# Altium schematic sheet 200_DCDC_5V-3V3_USBC.SchDoc
size B; SheetNumber: 4; SheetTotal: 4
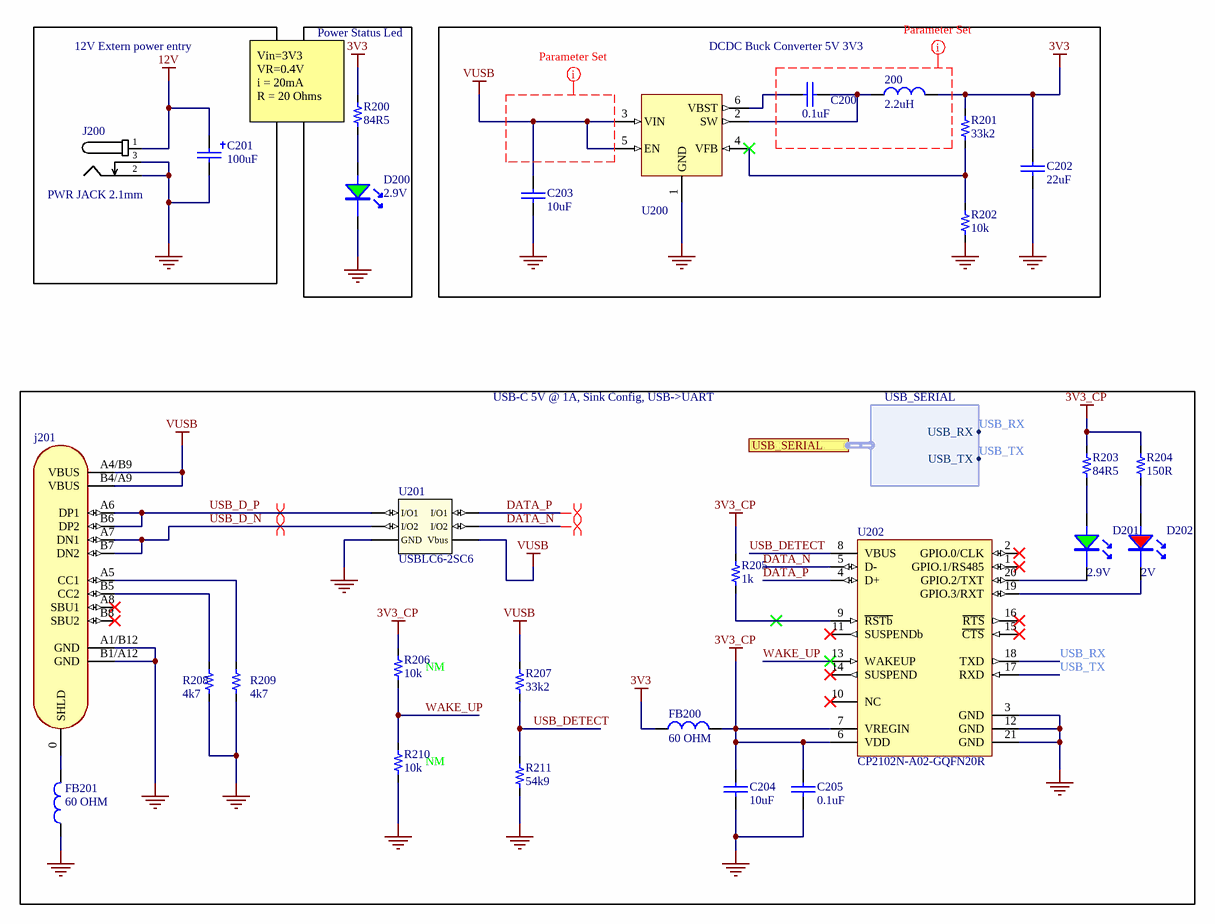
[diagram p0: 200_DCDC_5V-3V3_USBC.SchDoc]

## Parts
200  value 2.2uH  [Ind_5.8*5.2_NS]  (hidden comment: 2.2uH 4A)
C200  value 0.1uF  [0603_cap]  (hidden comment: 0.1uF 50V)
C201  value 100uF  [CAP_TH_2.5MM_6.3*12MM]  (hidden comment: 100uF 35V)
C202  value 22uF  [0603_cap]  (hidden comment: 22uF 10V)
C203  value 10uF  [0603_cap]  (hidden comment: 10uF 10V)
C204  value 10uF  [0603_cap]  (hidden comment: 10uF 10V)
C205  value 0.1uF  [0603_cap]  (hidden comment: 0.1uF 50V)
D200  2.9V  [0805_LED]
D201  2.9V  [0805_LED]
D202  2V  [0805_LED]
FB200  value 60 OHM  [0603_fb]  (hidden comment: 60OHM 2A)
FB201  value 60 OHM  [0603_fb]  (hidden comment: 60OHM 2A)
J200  PWR JACK 2.1mm  [CON_POWER_BARREL_2.1MM_3CONN]
j201  USB C  [CON_USB_C_16P_RA]  (value not drawn)
R200  value 84R5  [0603_res]  (hidden comment: 84R5 1/10W)
R201  value 33k2  [0603_res]  (hidden comment: 33k2 1/10W)
R202  value 10k  [0603_res]  (hidden comment: 10k 1/10W)
R203  value 84R5  [0603_res]  (hidden comment: 84R5 1/10W)
R204  value 150R  [0603_res]  (hidden comment: 150R 1/10W)
R205  value 1k  [0603_res]  (hidden comment: 1k 1/10W)
R206  value 10k  Usage: NM  [0603_res]  (hidden comment: 10k 1/10W)
R207  value 33k2  [0603_res]  (hidden comment: 33k2 1/10W)
R208  value 4k7  [0603_res]  (hidden comment: 4k7 1/10W)
R209  value 4k7  [0603_res]  (hidden comment: 4k7 1/10W)
R210  value 10k  Usage: NM  [0603_res]  (hidden comment: 10k 1/10W)
R211  value 54k9  [0603_res]  (hidden comment: 54k9 1/10W)
U200  TPS564201DDCR  [SOT_23_6]  (value not drawn)
U201  USBLC6-2SC6  [SOT_23_6]
U202  CP2102N-A02-GQFN20R  [WFQFN_20_EP_3X3MM]

## Blocks framed on the sheet
12V Extern power entry: C201 J200
Power Status Led: D200 R200
DCDC Buck Converter 5V 3V3: 200 C200 C202 C203 R201 R202 U200
USB-C 5V @ 1A, Sink Config, USB->UART: C204 C205 D201 D202 FB200 FB201 j201 R203-R211 U201 U202

## Ports
USB_SERIAL (harness USB_SERIAL, see Main[2C], 000_MCUs[2C])

## Harnesses
USB_SERIAL: USB_RX, USB_TX

## Nets
3V3: 200.2 C202.1 FB200.1 R200.1 R201.2
3V3_CP: C204.1 C205.1 FB200.2 R203.2 R204.2 R205.2 R206.2 U202.6(VDD) U202.7(VREGIN)
12V: C201.1 J200.1
GND: C201.2 C202.2 C203.2 C204.2 C205.2 D200.2 FB201.1 J200.2 J200.3 j201.A1/B12(GND) j201.B1/A12(GND) R202.1 R208.1 R209.1 R210.1 R211.1 U200.1(GND) U201.2(GND) U202.3(GND) U202.12(GND) U202.21(GND)
VUSB: C203.1 j201.A4/B9(VBUS) j201.B4/A9(VBUS) R207.2 U200.3(VIN) U200.5(EN) U201.5(Vbus)
DATA_N: U201.4(I/O2) U202.5(D-)
DATA_P: U201.6(I/O1) U202.4(D+)
USB_D_N: j201.A7(DN1) j201.B7(DN2) U201.3(I/O2)
USB_D_P: j201.A6(DP1) j201.B6(DP2) U201.1(I/O1)
USB_DETECT: R207.1 R211.2 U202.8(VBUS)
USB_RX: U202.18(TXD) ; port USB_SERIAL.USB_RX
USB_TX: U202.17(RXD) ; port USB_SERIAL.USB_TX
WAKE_UP: R206.1 R210.2 U202.13(WAKEUP)
Net200_1: 200.1 C200.1 U200.2(SW)
NetC200_2: C200.2 U200.6(VBST)
NetD200_1: D200.1(A) R200.2
NetD201_1: D201.1(A) R203.1
NetD201_2: D201.2 U202.20(GPIO.2/TXT)
NetD202_1: D202.1(A) R204.1
NetD202_2: D202.2 U202.19(GPIO.3/RXT)
NetFB201_2: FB201.2 j201.0(SHLD)
Netj201_A5: j201.A5(CC1) R209.2
Netj201_B5: j201.B5(CC2) R208.2
NetR201_1: R201.1 R202.2 U200.4(VFB)
NetR205_1: R205.1 U202.9(~{RSTb})

Not connected (* = marked no-connect by the designer): j201 A8(SBU1)* B8(SBU2)*; U202 1(GPIO.1/RS485)* 2(GPIO.0/CLK)* 10(NC)* 11(SUSPENDb)* 14(SUSPEND)* 15(~{CTS})* 16(~{RTS})*

## Layout directives
differential pair; differential pair class USB_2.0: DATA_N, DATA_P, USB_D_N, USB_D_P
net class 5V_1A: (no net found under the mark)

## Notes on the sheet
- (near R200) Vin=3V3
  VR=0.4V
  i = 20mA
  R = 20 Ohms

## Library data of the parts
200 = Inductor_2.2uH_4A_5.8*5.2mm: 4A 2.2uH ±20% 22.1mΩ SMD,5.8x5.2mm Inductors (SMD) ROHS; Manufacturer: SHOU HAN; Manufacturer Part Number: CY54-2.2UH; Supplier 1: LCSC; Supplier Part Number 1: C2929427; ComponentLink1Description: LCSC; ComponentLink1URL: https://lcsc.com/product-detail/Inductors-SMD_SHOU-HAN-CY54-2-2UH_C2929427.html
C200 C205 = Cap_0.1uF_0603_50V: 50V 100nF Y5V -20%~+80% 0603 Multilayer Ceramic Capacitors MLCC - SMD/SMT ROHS; Manufacturer: Walsin Tech Corp; Manufacturer Part Number: 0603F104Z500CT; Supplier 1: LCSC; Supplier Part Number 1: C83060; ComponentLink1Description: LCSC; ComponentLink1URL: https://www.lcsc.com/product-detail/Multilayer-Ceramic-Capacitors-MLCC-SMD-SMT_Walsin-Tech-Corp-0603F104Z500CT_C83060.html
C201 = Cap_100uF_ALU_TH_35V: 100uF 35V ±20% Plugin,D6.3xL12mm Aluminum Electrolytic Capacitors - Leaded ROHS; Manufacturer: HRK; Manufacturer Part Number: 35V100uF CD110; Supplier 1: LCSC; Supplier Part Number 1: C2960381; ComponentLink1Description: LCSC; ComponentLink1URL: https://lcsc.com/product-detail/Aluminum-Electrolytic-Capacitors-Leaded_HRK-35V100uF-CD110_C2960381.html
C202 = Cap_22uF_0603_10V: 10V 22uF X5R ±20% 0603 Multilayer Ceramic Capacitors MLCC - SMD/SMT ROHS; Manufacturer: HRE; Manufacturer Part Number: CGA0603X5R226M100JT; Supplier 1: LCSC; Supplier Part Number 1: C6119863; ComponentLink1Description: LCSC; ComponentLink1URL: https://lcsc.com/product-detail/Multilayer-Ceramic-Capacitors-MLCC-SMD-SMT_HRE-CGA0603X5R226M100JT_C6119863.html
C203 C204 = Cap_10uF_0603_10V: 10V 10uF X5R ±10% 0603 Multilayer Ceramic Capacitors MLCC - SMD/SMT ROHS; Manufacturer: CCTC; Manufacturer Part Number: TCC0603X5R106K100CT; Supplier 1: LCSC; Supplier Part Number 1: C380314; ComponentLink1Description: LCSC; ComponentLink1URL: https://www.lcsc.com/product-detail/Multilayer-Ceramic-Capacitors-MLCC-SMD-SMT_CCTC-TCC0603X5R106K100CT_C380314.html
D200 D201 = LED_0805_Green: LED GREEN CLEAR 0805 SMD; Manufacturer: XINGLIGHT; Manufacturer Part Number: XL-2012UGC; Supplier 1: LCSC; Supplier Part Number 1: C965815; ComponentLink1Description: LCSC; ComponentLink1URL: https://www.lcsc.com/product-detail/Light-Emitting-Diodes-LED_XINGLIGHT-XL-2012UGC_C965815.html
D202 = LED_0805_RED: LED RED CLEAR 0805 SMD; Manufacturer: XINGLIGHT; Manufacturer Part Number: XL-2012SURC; Supplier 1: LCSC; Supplier Part Number 1: C965812; ComponentLink1Description: LCSC; ComponentLink1URL: https://www.lcsc.com/product-detail/Light-Emitting-Diodes-LED_XINGLIGHT-XL-2012SURC_C965812.html
FB200 FB201 = FB_60_0603_2A: 2A 1 100mΩ 60Ω@100MHz ±25% 0603 Ferrite Beads ROHS; Manufacturer: TAI-TECH; Manufacturer Part Number: HCB1608KF-600T20; ComponentLink1Description: LCSC; ComponentLink1URL: https://www.lcsc.com/product-detail/Ferrite-Beads_TAI-TECH-HCB1608KF-600T20_C369516.html; Supplier 1: LCSC; Supplier Part Number 1: C369516
J200 = Con_Power_Jack_2.1mm_3pins: CONN PWR JACK 2X5.5MM SOLDER; Manufacturer: HCTL; Manufacturer Part Number: HC-DC-005-2.0T; Supplier 1: LCSC; Supplier Part Number 1: C3010533; ComponentLink1Description: LCSC; ComponentLink1URL: https://www.lcsc.com/product-detail/AC-DC-Power-Connectors_HCTL-HC-DC-005-2-0T_C3010533.html
j201 = CON_USB_TYPEC_16P: 3A USB 3.1 1 Surface Mount 16P Female -40℃~+85℃ Type-C SMD USB Connectors ROHS; Manufacturer: SHOU HAN; Manufacturer Part Number: TYPE-C-3.1-16PIN; Supplier 1: LCSC; Supplier Part Number 1: C7507405; ComponentLink1Description: LCSC; ComponentLink1URL: https://lcsc.com/product-detail/USB-Connectors_SHOU-HAN-TYPE-C-3-1-16PIN_C7507405.html
R200 R203 = Res_84R5_0603_1/10W: 100mW Thick Film Resistor 50V ±100ppm/℃ ±1% 84.5Ω 0603 Chip Resistor - Surface Mount ROHS; Manufacturer: LIZ Elec; Manufacturer Part Number: CR0603FA84R5G; ComponentLink1URL: https://lcsc.com/product-detail/Chip-Resistor-Surface-Mount_LIZ-Elec-CR0603FA84R5G_C101216.html; Supplier 1: LCSC; Supplier Part Number 1: C101216; ComponentLink1Description: LCSC
R201 R207 = Res_33k2_0603_1/10W: 100mW Thick Film Resistor 75V ±100ppm/℃ ±1% 33.2kΩ 0603 Chip Resistor - Surface Mount ROHS; Manufacturer: YAGEO; Manufacturer Part Number: RC0603FR-0733K2L; ComponentLink1URL: https://lcsc.com/product-detail/Chip-Resistor-Surface-Mount_YAGEO-RC0603FR-0733K2L_C185338.html; Supplier 1: LCSC; Supplier Part Number 1: C185338; ComponentLink1Description: LCSC
R202 R206 R210 = Res_10k_0603_1/10W: RES SMD 10k OHM 5% 1/10W 0603; Manufacturer: FOJAN; Manufacturer Part Number: FRC0603J103TS; ComponentLink1URL: https://www.lcsc.com/product-detail/Chip-Resistor-Surface-Mount_FOJAN-FRC0603J103TS_C2930027.html; Supplier 1: LCSC; Supplier Part Number 1: C2930027; ComponentLink1Description: LCSC
R204 = Res_150R_0603_1/10W: 100mW Thick Film Resistor 75V ±100ppm/℃ ±1% 150Ω 0603 Chip Resistor - Surface Mount ROHS; Manufacturer: RALEC; Manufacturer Part Number: RTT031500FTP; ComponentLink1URL: https://lcsc.com/product-detail/Chip-Resistor-Surface-Mount_RALEC-RTT031500FTP_C103302.html; Supplier 1: LCSC; Supplier Part Number 1: C103302; ComponentLink1Description: LCSC
R205 = Res_1k_0603_1/10W: RES SMD 1k OHM 5% 1/10W 0603; Manufacturer: FOJAN; Manufacturer Part Number: FRC0603J102 TS; ComponentLink1URL: https://www.lcsc.com/product-detail/Chip-Resistor-Surface-Mount_FOJAN-FRC0603J102-TS_C2907113.html; Supplier 1: LCSC; Supplier Part Number 1: C2907113; ComponentLink1Description: LCSC
R208 R209 = Res_4k7_0603_1/10W: 100mW Thick Film Resistor 75V ±1% 4.7kΩ 0603 Chip Resistor - Surface Mount ROHS; Manufacturer: VO; Manufacturer Part Number: SCR0603F4K7; ComponentLink1URL: https://lcsc.com/product-detail/Chip-Resistor-Surface-Mount_VO-SCR0603F4K7_C3016318.html; Supplier 1: LCSC; Supplier Part Number 1: C3016318; ComponentLink1Description: LCSC
R211 = Res_54k9_0603_1/10W: 100mW Thick Film Resistor 75V ±100ppm/℃ ±1% 54.9kΩ 0603 Chip Resistor - Surface Mount ROHS; Manufacturer: YAGEO; Manufacturer Part Number: RC0603FR-0754K9L; ComponentLink1URL: https://lcsc.com/product-detail/Chip-Resistor-Surface-Mount_YAGEO-RC0603FR-0754K9L_C185321.html; Supplier 1: LCSC; Supplier Part Number 1: C185321; ComponentLink1Description: LCSC
U200 = DCDC_SW_BUCK_4A_SOT23-6: IC REG BUCK ADJ 4A SOT23; Manufacturer: Texas Instruments; Manufacturer Part Number: TPS564201DDCR; Supplier 1: LCSC; Supplier Part Number 1: C464812; ComponentLink1Description: LCSC; ComponentLink1URL: https://lcsc.com/product-detail/DC-DC-Converters_Texas-Instruments-TPS564201DDCR_C464812.html
U201 = TVS_5.25V_2CH_SOT_23_6: TVS DIODE 5.25V 17V SOT23-6; Manufacturer: STMicroelectronics; ComponentLink1Description: LCSC; ComponentLink1URL: https://www.lcsc.com/product-detail/ESD-Protection-Devices_STMicroelectronics-USBLC6-2SC6_C7519.html; Supplier 1: LCSC; Manufacturer Part Number: USBLC6-2SC6; Supplier Part Number 1: C7519
U202 = IC_SGL_USB2UART-BRIDGE_20QFN: IC USB TO UART BRIDGE QFN20; Manufacturer: Silicon Labs; Manufacturer Part Number: CP2102N-A02-GQFN20R; Supplier 1: LCSC; Supplier Part Number 1: C969913; ComponentLink1Description: LCSC; ComponentLink1URL: https://www.lcsc.com/product-detail/USB-ICs_SILICON-LABS-CP2102N-A02-GQFN20R_C969913.html